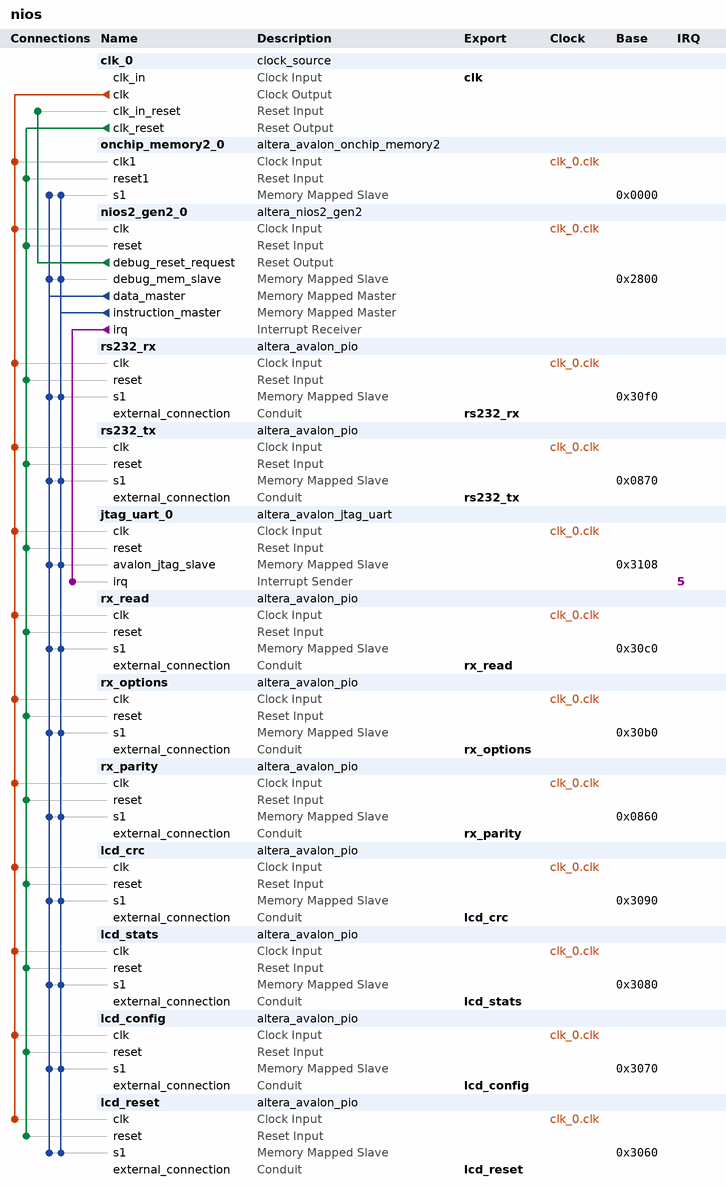
[diagram p0: system contents]
# Platform Designer (Qsys) system nios, Cyclone IV E EP4CE22F17C6
# Parameters at their usual value, and those the tool derives, are not listed.
package require -exact qsys 15.0
create_system nios
set_project_property DEVICE_FAMILY {Cyclone IV E}
set_project_property DEVICE EP4CE22F17C6

add_instance clk_0 clock_source 15.0
set_instance_parameter_value clk_0 clockFrequency 50000000

add_instance onchip_memory2_0 altera_avalon_onchip_memory2 15.0
set_instance_parameter_value onchip_memory2_0 dataWidth 32
set_instance_parameter_value onchip_memory2_0 dualPort false
set_instance_parameter_value onchip_memory2_0 initMemContent true
set_instance_parameter_value onchip_memory2_0 initializationFileName onchip_mem.hex
set_instance_parameter_value onchip_memory2_0 memorySize 2048

add_instance nios2_gen2_0 altera_nios2_gen2 15.0
set_instance_parameter_value nios2_gen2_0 dcache_size 2048
set_instance_parameter_value nios2_gen2_0 exceptionSlave nios2_gen2_0.debug_mem_slave
set_instance_parameter_value nios2_gen2_0 icache_size 4096
set_instance_parameter_value nios2_gen2_0 impl Tiny
set_instance_parameter_value nios2_gen2_0 resetSlave nios2_gen2_0.debug_mem_slave

add_instance rs232_rx altera_avalon_pio 15.0
set_instance_parameter_value rs232_rx direction Input
set_instance_parameter_value rs232_rx width 8

add_instance rs232_tx altera_avalon_pio 15.0
set_instance_parameter_value rs232_tx direction Output
set_instance_parameter_value rs232_tx width 8

add_instance jtag_uart_0 altera_avalon_jtag_uart 15.0
set_instance_parameter_value jtag_uart_0 simInteractiveOptions NO_INTERACTIVE_WINDOWS

add_instance rx_read altera_avalon_pio 15.0
set_instance_parameter_value rx_read direction InOut
set_instance_parameter_value rx_read width 1

add_instance rx_options altera_avalon_pio 15.0
set_instance_parameter_value rx_options direction Output
set_instance_parameter_value rx_options width 8

add_instance rx_parity altera_avalon_pio 15.0
set_instance_parameter_value rx_parity direction Input
set_instance_parameter_value rx_parity width 1

add_instance lcd_crc altera_avalon_pio 15.0
set_instance_parameter_value lcd_crc direction Output
set_instance_parameter_value lcd_crc width 32

add_instance lcd_stats altera_avalon_pio 15.0
set_instance_parameter_value lcd_stats direction Output
set_instance_parameter_value lcd_stats width 1

add_instance lcd_config altera_avalon_pio 15.0
set_instance_parameter_value lcd_config direction Output
set_instance_parameter_value lcd_config width 2

add_instance lcd_reset altera_avalon_pio 15.0
set_instance_parameter_value lcd_reset direction Output
set_instance_parameter_value lcd_reset width 1

# connections
add_connection clk_0.clk jtag_uart_0.clk clock
add_connection clk_0.clk lcd_config.clk clock
add_connection clk_0.clk lcd_crc.clk clock
add_connection clk_0.clk lcd_reset.clk clock
add_connection clk_0.clk lcd_stats.clk clock
add_connection clk_0.clk nios2_gen2_0.clk clock
add_connection clk_0.clk onchip_memory2_0.clk1 clock
add_connection clk_0.clk rs232_rx.clk clock
add_connection clk_0.clk rs232_tx.clk clock
add_connection clk_0.clk rx_options.clk clock
add_connection clk_0.clk rx_parity.clk clock
add_connection clk_0.clk rx_read.clk clock
add_connection clk_0.clk_reset jtag_uart_0.reset reset
add_connection clk_0.clk_reset lcd_config.reset reset
add_connection clk_0.clk_reset lcd_crc.reset reset
add_connection clk_0.clk_reset lcd_reset.reset reset
add_connection clk_0.clk_reset lcd_stats.reset reset
add_connection clk_0.clk_reset nios2_gen2_0.reset reset
add_connection clk_0.clk_reset onchip_memory2_0.reset1 reset
add_connection clk_0.clk_reset rs232_rx.reset reset
add_connection clk_0.clk_reset rs232_tx.reset reset
add_connection clk_0.clk_reset rx_options.reset reset
add_connection clk_0.clk_reset rx_parity.reset reset
add_connection clk_0.clk_reset rx_read.reset reset
add_connection nios2_gen2_0.debug_reset_request clk_0.clk_in_reset reset
add_connection nios2_gen2_0.data_master jtag_uart_0.avalon_jtag_slave avalon
set_connection_parameter_value nios2_gen2_0.data_master/jtag_uart_0.avalon_jtag_slave baseAddress 0x3108
add_connection nios2_gen2_0.data_master lcd_config.s1 avalon
set_connection_parameter_value nios2_gen2_0.data_master/lcd_config.s1 baseAddress 0x3070
add_connection nios2_gen2_0.data_master lcd_crc.s1 avalon
set_connection_parameter_value nios2_gen2_0.data_master/lcd_crc.s1 baseAddress 0x3090
add_connection nios2_gen2_0.data_master lcd_reset.s1 avalon
set_connection_parameter_value nios2_gen2_0.data_master/lcd_reset.s1 baseAddress 0x3060
add_connection nios2_gen2_0.data_master lcd_stats.s1 avalon
set_connection_parameter_value nios2_gen2_0.data_master/lcd_stats.s1 baseAddress 0x3080
add_connection nios2_gen2_0.data_master nios2_gen2_0.debug_mem_slave avalon
set_connection_parameter_value nios2_gen2_0.data_master/nios2_gen2_0.debug_mem_slave baseAddress 0x2800
add_connection nios2_gen2_0.data_master onchip_memory2_0.s1 avalon
set_connection_parameter_value nios2_gen2_0.data_master/onchip_memory2_0.s1 baseAddress 0x0000
add_connection nios2_gen2_0.data_master rs232_rx.s1 avalon
set_connection_parameter_value nios2_gen2_0.data_master/rs232_rx.s1 baseAddress 0x30f0
add_connection nios2_gen2_0.data_master rs232_tx.s1 avalon
set_connection_parameter_value nios2_gen2_0.data_master/rs232_tx.s1 baseAddress 0x0870
add_connection nios2_gen2_0.data_master rx_options.s1 avalon
set_connection_parameter_value nios2_gen2_0.data_master/rx_options.s1 baseAddress 0x30b0
add_connection nios2_gen2_0.data_master rx_parity.s1 avalon
set_connection_parameter_value nios2_gen2_0.data_master/rx_parity.s1 baseAddress 0x0860
add_connection nios2_gen2_0.data_master rx_read.s1 avalon
set_connection_parameter_value nios2_gen2_0.data_master/rx_read.s1 baseAddress 0x30c0
add_connection nios2_gen2_0.instruction_master jtag_uart_0.avalon_jtag_slave avalon
set_connection_parameter_value nios2_gen2_0.instruction_master/jtag_uart_0.avalon_jtag_slave baseAddress 0x3108
add_connection nios2_gen2_0.instruction_master lcd_config.s1 avalon
set_connection_parameter_value nios2_gen2_0.instruction_master/lcd_config.s1 baseAddress 0x3070
add_connection nios2_gen2_0.instruction_master lcd_crc.s1 avalon
set_connection_parameter_value nios2_gen2_0.instruction_master/lcd_crc.s1 baseAddress 0x3090
add_connection nios2_gen2_0.instruction_master lcd_reset.s1 avalon
set_connection_parameter_value nios2_gen2_0.instruction_master/lcd_reset.s1 baseAddress 0x3060
add_connection nios2_gen2_0.instruction_master lcd_stats.s1 avalon
set_connection_parameter_value nios2_gen2_0.instruction_master/lcd_stats.s1 baseAddress 0x3080
add_connection nios2_gen2_0.instruction_master nios2_gen2_0.debug_mem_slave avalon
set_connection_parameter_value nios2_gen2_0.instruction_master/nios2_gen2_0.debug_mem_slave baseAddress 0x2800
add_connection nios2_gen2_0.instruction_master onchip_memory2_0.s1 avalon
set_connection_parameter_value nios2_gen2_0.instruction_master/onchip_memory2_0.s1 baseAddress 0x0000
add_connection nios2_gen2_0.instruction_master rs232_rx.s1 avalon
set_connection_parameter_value nios2_gen2_0.instruction_master/rs232_rx.s1 baseAddress 0x30f0
add_connection nios2_gen2_0.instruction_master rs232_tx.s1 avalon
set_connection_parameter_value nios2_gen2_0.instruction_master/rs232_tx.s1 baseAddress 0x0870
add_connection nios2_gen2_0.instruction_master rx_options.s1 avalon
set_connection_parameter_value nios2_gen2_0.instruction_master/rx_options.s1 baseAddress 0x30b0
add_connection nios2_gen2_0.instruction_master rx_parity.s1 avalon
set_connection_parameter_value nios2_gen2_0.instruction_master/rx_parity.s1 baseAddress 0x0860
add_connection nios2_gen2_0.instruction_master rx_read.s1 avalon
set_connection_parameter_value nios2_gen2_0.instruction_master/rx_read.s1 baseAddress 0x30c0
add_connection nios2_gen2_0.irq jtag_uart_0.irq interrupt
set_connection_parameter_value nios2_gen2_0.irq/jtag_uart_0.irq irqNumber 5

# exported interfaces
add_interface clk clock sink
set_interface_property clk EXPORT_OF clk_0.clk_in
add_interface lcd_config conduit end
set_interface_property lcd_config EXPORT_OF lcd_config.external_connection
add_interface lcd_crc conduit end
set_interface_property lcd_crc EXPORT_OF lcd_crc.external_connection
add_interface lcd_reset conduit end
set_interface_property lcd_reset EXPORT_OF lcd_reset.external_connection
add_interface lcd_stats conduit end
set_interface_property lcd_stats EXPORT_OF lcd_stats.external_connection
add_interface rs232_rx conduit end
set_interface_property rs232_rx EXPORT_OF rs232_rx.external_connection
add_interface rs232_tx conduit end
set_interface_property rs232_tx EXPORT_OF rs232_tx.external_connection
add_interface rx_options conduit end
set_interface_property rx_options EXPORT_OF rx_options.external_connection
add_interface rx_parity conduit end
set_interface_property rx_parity EXPORT_OF rx_parity.external_connection
add_interface rx_read conduit end
set_interface_property rx_read EXPORT_OF rx_read.external_connection

set_interconnect_requirement {$system} qsys_mm.clockCrossingAdapter HANDSHAKE
set_interconnect_requirement {$system} qsys_mm.enableEccProtection FALSE
set_interconnect_requirement {$system} qsys_mm.insertDefaultSlave FALSE
set_interconnect_requirement {$system} qsys_mm.maxAdditionalLatency 1

save_system nios.qsys
